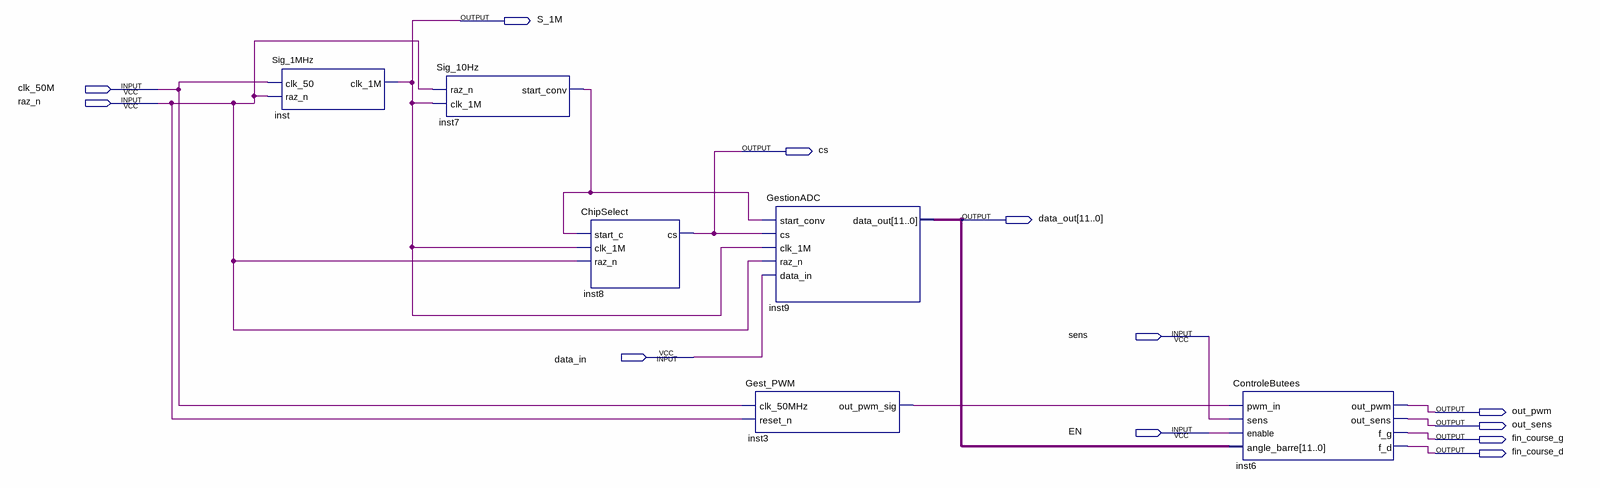
[diagram p0: schematic sheet]
// Quartus schematic Verin.bdf as structural Verilog: 6 symbols, 12 pins
module Verin (
  input  clk_50M,
  input  raz_n,
  input  sens,
  input  data_in,
  input  EN,
  output S_1M,
  output cs,
  output [11:0] data_out,
  output out_pwm,
  output out_sens,
  output fin_course_g,
  output fin_course_d
);

  wire inst3_out_pwm_sig, inst7_start_conv;

  Sig_1MHz inst (.clk_50(clk_50M), .raz_n(raz_n), .clk_1M(S_1M));
  Sig_10Hz inst7 (.raz_n(raz_n), .clk_1M(S_1M), .start_conv(inst7_start_conv));
  ChipSelect inst8 (.start_c(inst7_start_conv), .clk_1M(S_1M), .raz_n(raz_n), .cs(cs));
  GestionADC inst9 (
    .start_conv(inst7_start_conv), .cs(cs), .clk_1M(S_1M), .raz_n(raz_n), .data_in(data_in),
    .data_out(data_out));
  Gest_PWM inst3 (.clk_50MHz(clk_50M), .reset_n(raz_n), .out_pwm_sig(inst3_out_pwm_sig));
  ControleButees inst6 (
    .pwm_in(inst3_out_pwm_sig), .sens(sens), .enable(EN), .angle_barre(data_out), .out_pwm(out_pwm),
    .out_sens(out_sens), .f_g(fin_course_g), .f_d(fin_course_d));
endmodule
